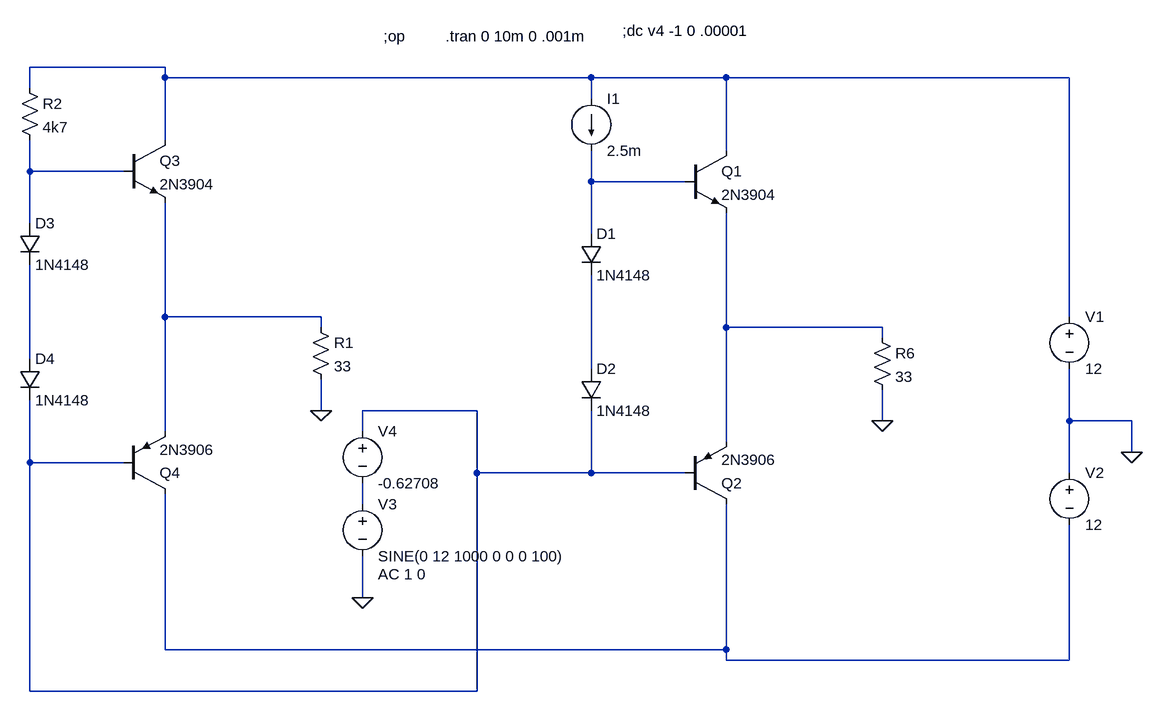
[diagram p0: schematic claseab9.asc]
claseab9.asc, the LTspice schematic file:
Version 4
SHEET 1 1172 680
WIRE -336 -560 -544 -560
WIRE -336 -544 -336 -560
WIRE 320 -544 -336 -544
WIRE 528 -544 320 -544
WIRE 1056 -544 528 -544
WIRE -544 -528 -544 -560
WIRE 320 -512 320 -544
WIRE -336 -448 -336 -544
WIRE 528 -432 528 -544
WIRE -544 -400 -544 -448
WIRE -480 -400 -544 -400
WIRE -400 -400 -480 -400
WIRE 320 -384 320 -432
WIRE 384 -384 320 -384
WIRE 464 -384 384 -384
WIRE -544 -320 -544 -400
WIRE 320 -304 320 -384
WIRE -336 -176 -336 -352
WIRE -272 -176 -336 -176
WIRE -96 -176 -272 -176
WIRE 1056 -176 1056 -544
WIRE -96 -160 -96 -176
WIRE 528 -160 528 -336
WIRE 592 -160 528 -160
WIRE 768 -160 592 -160
WIRE 768 -144 768 -160
WIRE -544 -112 -544 -256
WIRE 320 -96 320 -240
WIRE -96 -32 -96 -80
WIRE 144 -32 -32 -32
WIRE 768 -16 768 -64
WIRE 1056 -16 1056 -96
WIRE 1152 -16 1056 -16
WIRE -336 0 -336 -176
WIRE -32 0 -32 -32
WIRE 528 16 528 -160
WIRE 1152 32 1152 -16
WIRE -544 48 -544 -48
WIRE -480 48 -544 48
WIRE -400 48 -480 48
WIRE 144 64 144 -32
WIRE 320 64 320 -32
WIRE 320 64 144 64
WIRE 384 64 320 64
WIRE 464 64 384 64
WIRE 1056 64 1056 -16
WIRE -32 112 -32 80
WIRE -32 256 -32 192
WIRE -336 336 -336 96
WIRE 528 336 528 112
WIRE 528 336 -336 336
WIRE 528 352 528 336
WIRE 1056 352 1056 144
WIRE 1056 352 528 352
WIRE -544 400 -544 48
WIRE 144 400 144 64
WIRE 144 400 -544 400
FLAG 1152 32 0
FLAG -32 256 0
FLAG 768 -16 0
FLAG -96 -32 0
DATAFLAG 592 -160 ""
DATAFLAG 384 64 ""
DATAFLAG 384 -384 ""
DATAFLAG -272 -176 ""
DATAFLAG -480 48 ""
DATAFLAG -480 -400 ""
SYMBOL voltage 1056 -192 R0
WINDOW 123 0 0 Left 2
WINDOW 39 0 0 Left 2
SYMATTR InstName V1
SYMATTR Value 12
SYMBOL voltage 1056 48 R0
WINDOW 123 0 0 Left 2
WINDOW 39 0 0 Left 2
SYMATTR InstName V2
SYMATTR Value 12
SYMBOL voltage -32 96 R0
WINDOW 123 24 124 Left 2
WINDOW 39 0 0 Left 2
SYMATTR Value2 AC 1 0
SYMATTR InstName V3
SYMATTR Value SINE(0 12 1000 0 0 0 100)
SYMBOL npn 464 -432 R0
SYMATTR InstName Q1
SYMATTR Value 2N3904
SYMBOL pnp 464 112 M180
SYMATTR InstName Q2
SYMATTR Value 2N3906
SYMBOL res 752 -160 R0
SYMATTR InstName R6
SYMATTR Value 33
SYMBOL diode 304 -304 R0
SYMATTR InstName D1
SYMATTR Value 1N4148
SYMBOL diode 304 -96 R0
SYMATTR InstName D2
SYMATTR Value 1N4148
SYMBOL current 320 -512 R0
WINDOW 123 0 0 Left 2
WINDOW 39 0 0 Left 2
SYMATTR InstName I1
SYMATTR Value 2.5m
SYMBOL voltage -32 -16 R0
WINDOW 123 0 0 Left 2
WINDOW 39 0 0 Left 2
SYMATTR InstName V4
SYMATTR Value -0.62708
SYMBOL npn -400 -448 R0
SYMATTR InstName Q3
SYMATTR Value 2N3904
SYMBOL pnp -400 96 M180
SYMATTR InstName Q4
SYMATTR Value 2N3906
SYMBOL res -112 -176 R0
SYMATTR InstName R1
SYMATTR Value 33
SYMBOL diode -560 -320 R0
SYMATTR InstName D3
SYMATTR Value 1N4148
SYMBOL diode -560 -112 R0
SYMATTR InstName D4
SYMATTR Value 1N4148
SYMBOL res -560 -544 R0
SYMATTR InstName R2
SYMATTR Value 4k7
TEXT 0 -608 Left 2 !;op
TEXT 368 -616 Left 2 !;dc v4 -1 0 .00001
TEXT 96 -608 Left 2 !.tran 0 10m 0 .001m

The netlist it stands for:
* claseab9.asc
V1 N001 0 12
V2 0 N010 12
V3 N009 0 SINE(0 12 1000 0 0 0 100) AC 1 0
Q1 N001 N003 N005 0 2N3904
Q2 N010 N008 N005 0 2N3906
R6 N005 0 33
D1 N003 N007 1N4148
D2 N007 N008 1N4148
I1 N001 N003 2.5m
V4 N008 N009 -0.62708
Q3 N001 N002 N004 0 2N3904
Q4 N010 N008 N004 0 2N3906
R1 N004 0 33
D3 N002 N006 1N4148
D4 N006 N008 1N4148
R2 N001 N002 4k7
.model D D
.lib standard.dio
.model NPN NPN
.model PNP PNP
.lib standard.bjt
;op
;dc v4 -1 0 .00001
.tran 0 10m 0 .001m
.backanno
.end